# EAGLE design StellaBlue_v04 (EAGLE 9.1.0)
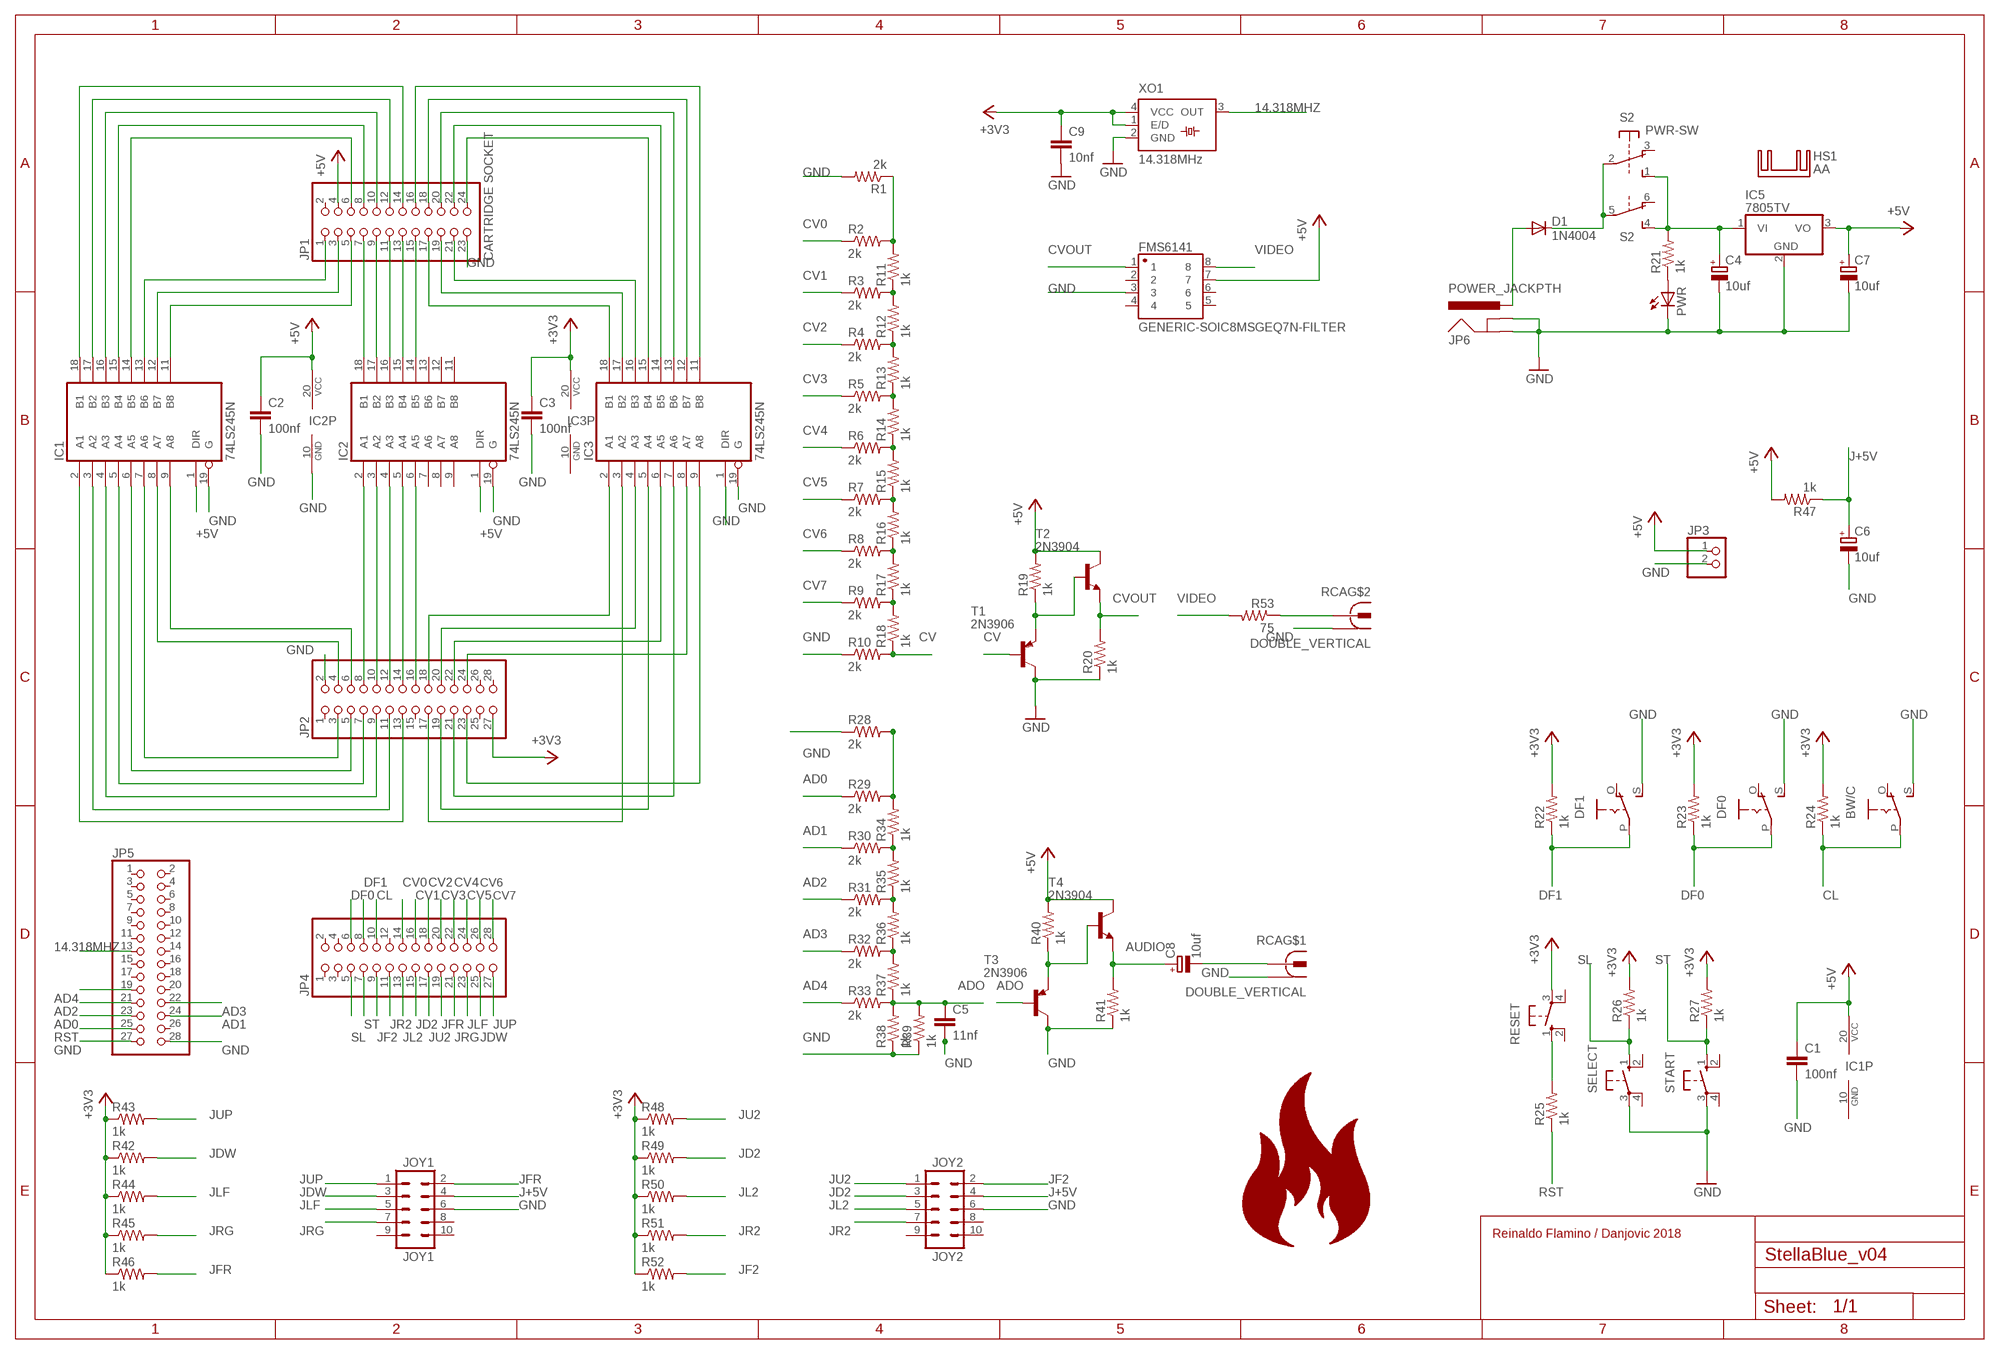
[diagram p0: schematic, sheet 1]

## Parts
BW/C  EG1218S  [EG1218]
C1  100nf  C5/2.5  [C5B2.5]
C2  100nf  C5/2.5  [C5B2.5]
C3  100nf  C5/2.5  [C5B2.5]
C4  10uf  CPOL-EUE2.5-6  [E2,5-6]
C5  11nf  C5/2.5  [C5B2.5]
C6  10uf  CPOL-EUTT2D6  [TT2D6]
C7  10uf  CPOL-EUE2.5-6  [E2,5-6]
C8  10uf  CPOL-EUE2.5-6  [E2,5-6]
C9  10nf  C5/2.5  [C5B2.5]
D1  1N4004  [DO41-10]
DF0  EG1218S  [EG1218]
DF1  EG1218S  [EG1218]
FMS6141  GENERIC-SOIC8MSGEQ7N-FILTER  [SO08]
HS1  AA  [AA]
IC1  74LS245N  [DIL20]
IC2  74LS245N  [DIL20]
IC3  74LS245N  [DIL20]
IC5  7805TV  [TO220V]
JOY1  JOY1  M05X2SHD_LOCK  [2X5-SHROUDED_LOCK]
JOY2  JOY2  M05X2SHD_LOCK  [2X5-SHROUDED_LOCK]
JP1  CARTRIDGE SOCKET  ATARI2600_SLOT  [ATARI2600_SLOT]
JP2  PINHD-2X14  [2X14]
JP3  PINHD-1X2/90  [1X02/90]
JP4  PINHD-2X14  [2X14]
JP5  PINHD-2X14  [2X14]
JP6  POWER_JACKPTH  [POWER_JACK_PTH]
PWR  LED3MM  [LED3MM]
R1  2k  R-US_0207/7  [0207/7]
R2  2k  R-US_0207/7  [0207/7]
R3  2k  R-US_0207/7  [0207/7]
R4  2k  R-US_0207/7  [0207/7]
R5  2k  R-US_0207/7  [0207/7]
R6  2k  R-US_0207/7  [0207/7]
R7  2k  R-US_0207/7  [0207/7]
R8  2k  R-US_0207/7  [0207/7]
R9  2k  R-US_0207/7  [0207/7]
R10  2k  R-US_0207/7  [0207/7]
R11  1k  R-US_0207/7  [0207/7]
R12  1k  R-US_0207/7  [0207/7]
R13  1k  R-US_0207/7  [0207/7]
R14  1k  R-US_0207/7  [0207/7]
R15  1k  R-US_0207/7  [0207/7]
R16  1k  R-US_0207/7  [0207/7]
R17  1k  R-US_0207/7  [0207/7]
R18  1k  R-US_0207/7  [0207/7]
R19  1k  R-US_0207/7  [0207/7]
R20  1k  R-US_0207/7  [0207/7]
R21  1k  R-US_0207/7  [0207/7]
R22  1k  R-US_0207/7  [0207/7]
R23  1k  R-US_0207/7  [0207/7]
R24  1k  R-US_0207/7  [0207/7]
R25  1k  R-US_0207/7  [0207/7]
R26  1k  R-US_0207/7  [0207/7]
R27  1k  R-US_0207/7  [0207/7]
R28  2k  R-US_0207/7  [0207/7]
R29  2k  R-US_0207/7  [0207/7]
R30  2k  R-US_0207/7  [0207/7]
R31  2k  R-US_0207/7  [0207/7]
R32  2k  R-US_0207/7  [0207/7]
R33  2k  R-US_0207/7  [0207/7]
R34  1k  R-US_0207/7  [0207/7]
R35  1k  R-US_0207/7  [0207/7]
R36  1k  R-US_0207/7  [0207/7]
R37  1k  R-US_0207/7  [0207/7]
R38  1k  R-US_0207/7  [0207/7]
R39  1k  R-US_0207/7  [0207/7]
R40  1k  R-US_0207/7  [0207/7]
R41  1k  R-US_0207/7  [0207/7]
R42  1k  R-US_0207/7  [0207/7]
R43  1k  R-US_0207/7  [0207/7]
R44  1k  R-US_0207/7  [0207/7]
R45  1k  R-US_0207/7  [0207/7]
R46  1k  R-US_0207/7  [0207/7]
R47  1k  R-US_0207/7  [0207/7]
R48  1k  R-US_0207/7  [0207/7]
R49  1k  R-US_0207/7  [0207/7]
R50  1k  R-US_0207/7  [0207/7]
R51  1k  R-US_0207/7  [0207/7]
R52  1k  R-US_0207/7  [0207/7]
R53  75  R-US_0207/7  [0207/7]
RCA  DOUBLE_VERTICAL  [DOUBLE-VERTICAL]
RESET  10-XX  [B3F-10XX]
S2  PWR-SW  9077-2  [9077-2]
SELECT  10-XX  [B3F-10XX]
START  10-XX  [B3F-10XX]
T1  2N3906  2N3906-PNP-TO92-EBC  [TO92-EBC]
T2  2N3904  2N3904-NPN-TO92-EBC  [TO92-EBC]
T3  2N3906  2N3906-PNP-TO92-EBC  [TO92-EBC]
T4  2N3904  2N3904-NPN-TO92-EBC  [TO92-EBC]
XO1  14.318MHz  SM77H  [SM77H]

## Nets
14.318MHZ: JP5.13 XO1.3(OUT)
+3V3: C3.1 C9.1 IC3.20(VCC) JP2.27 R22.2 R23.2 R24.2 R26.2 R27.2 R42.1 R43.1 R44.1 R45.1 R46.1 R48.1 R49.1 R50.1 R51.1 R52.1 RESET.3(P) XO1.1(E/D) XO1.4(VCC)
+5V: C1.1 C2.1 C7.+ FMS6141.7 IC1.1(DIR) IC1.20(VCC) IC2.1(DIR) IC2.20(VCC) IC5.3(VO) JP1.4 JP3.1 R19.2 R40.2 R47.2 T2.C T4.C
AD0: JP5.23 R29.1
AD1: JP5.24 R30.1
AD2: JP5.21 R31.1
AD3: JP5.22 R32.1
AD4: JP5.19 R33.1
ADO: C5.1 R33.2 R37.1 R38.2 R39.2 T3.B
AUDIO: C8.+ R41.2 T4.E
CL: BW/C.P JP4.10 R24.1
CV: R10.2 R18.1 T1.B
CV0: JP4.14 R2.1
CV1: JP4.16 R3.1
CV2: JP4.18 R4.1
CV3: JP4.20 R5.1
CV4: JP4.22 R6.1
CV5: JP4.24 R7.1
CV6: JP4.26 R8.1
CV7: JP4.28 R9.1
CVOUT: FMS6141.1 R20.2 T2.E
DF0: DF0.P JP4.6 R23.1
DF1: DF1.P JP4.8 R22.1
GND: BW/C.S C1.2 C2.2 C3.2 C4.- C5.2 C6.- C7.- C9.2 DF0.S DF1.S FMS6141.3 IC1.19(G) IC2.10(GND) IC2.19(G) IC3.1(DIR) IC3.19(G) IC5.2(GND) JOY1.6 JOY2.6 JP1.23 JP2.2 JP3.2 JP5.27 JP5.28 JP6.GND JP6.GNDBREAK PWR.K(C) R1.2 R10.1 R20.1 R28.1 R38.1 R39.1 R41.1 RCA.HG RCA.LG SELECT.3(P) START.3(P) T1.C T3.C XO1.2(GND)
J+5V: C6.+ JOY1.4 JOY2.4 R47.1
JD2: JOY2.3 JP4.15 R49.2
JDW: JOY1.3 JP4.25 R42.2
JF2: JOY2.2 JP4.9 R52.2
JFR: JOY1.2 JP4.19 R46.2
JL2: JOY2.5 JP4.13 R50.2
JLF: JOY1.5 JP4.23 R44.2
JR2: JOY2.7 JP4.11 R51.2
JRG: JOY1.7 JP4.21 R45.2
JU2: JOY2.1 JP4.17 R48.2
JUP: JOY1.1 JP4.27 R43.2
N$1: IC1.18(B1) JP1.14
N$2: IC1.17(B2) JP1.12
N$3: IC1.16(B3) JP1.10
N$4: IC1.15(B4) JP1.8
N$5: IC1.14(B5) JP1.6
N$6: IC1.13(B6) JP1.1
N$7: IC1.12(B7) JP1.3
N$8: IC1.11(B8) JP1.5
N$9: IC2.18(B1) JP1.7
N$10: IC2.17(B2) JP1.9
N$11: IC2.16(B3) JP1.11
N$12: IC2.15(B4) JP1.13
N$13: IC2.14(B5) JP1.15
N$14: IC3.18(B1) JP1.17
N$15: IC3.17(B2) JP1.19
N$16: IC3.16(B3) JP1.21
N$17: IC3.15(B4) JP1.24
N$18: IC3.14(B5) JP1.22
N$19: IC3.13(B6) JP1.20
N$20: IC3.12(B7) JP1.18
N$21: IC3.11(B8) JP1.16
N$22: IC1.2(A1) JP2.13
N$23: IC1.3(A2) JP2.11
N$24: IC1.4(A3) JP2.9
N$25: IC1.5(A4) JP2.7
N$26: IC1.6(A5) JP2.5
N$27: IC1.7(A6) JP2.3
N$28: IC1.8(A7) JP2.4
N$29: IC1.9(A8) JP2.6
N$30: IC2.2(A1) JP2.8
N$31: IC2.3(A2) JP2.10
N$32: IC2.4(A3) JP2.12
N$33: IC2.5(A4) JP2.14
N$34: IC2.6(A5) JP2.16
N$35: IC3.2(A1) JP2.18
N$36: IC3.3(A2) JP2.17
N$37: IC3.4(A3) JP2.20
N$38: IC3.5(A4) JP2.19
N$39: IC3.6(A5) JP2.22
N$40: IC3.7(A6) JP2.21
N$41: IC3.8(A7) JP2.24
N$42: IC3.9(A8) JP2.23
N$43: D1.A JP6.PWR
N$44: D1.C S2.2(1:P) S2.5(2:P)
N$45: R1.1 R2.2 R11.2
N$46: R3.2 R11.1 R12.2
N$47: R53.1 RCA.LS
N$49: C4.+ IC5.1(VI) R21.2 S2.1(1:S) S2.4(2:S)
N$50: R4.2 R12.1 R13.2
N$51: R5.2 R13.1 R14.2
N$52: R6.2 R14.1 R15.2
N$53: R7.2 R15.1 R16.2
N$54: R8.2 R16.1 R17.2
N$55: R9.2 R17.1 R18.2
N$57: R19.1 T1.E T2.B
N$58: PWR.A R21.1
N$59: R25.2 RESET.1(S)
N$62: R28.2 R29.2 R34.2
N$63: R30.2 R34.1 R35.2
N$64: R31.2 R35.1 R36.2
N$65: R32.2 R36.1 R37.2
N$67: R40.1 T3.E T4.B
N$68: C8.- RCA.HS
RST: JP5.25 R25.1
SL: JP4.5 R26.1 SELECT.1(S)
ST: JP4.7 R27.1 START.1(S)
VIDEO: FMS6141.8 R53.2
Unconnected: BW/C.O DF0.O DF1.O FMS6141.2 FMS6141.4 FMS6141.5 FMS6141.6 IC2.7(A6) IC2.8(A7) IC2.9(A8) IC2.11(B8) IC2.12(B7) IC2.13(B6) JOY1.8 JOY1.9 JOY1.10 JOY2.8 JOY2.9 JOY2.10 JP1.2 JP2.1 JP2.15 JP2.25 JP2.26 JP2.28 JP4.1 JP4.2 JP4.3 JP4.4 JP4.12 JP5.1 JP5.2 JP5.3 JP5.4 JP5.5 JP5.6 JP5.7 JP5.8 JP5.9 JP5.10 JP5.11 JP5.12 JP5.14 JP5.15 JP5.16 JP5.17 JP5.18 JP5.20 JP5.26 RESET.2(S1) RESET.4(P1) S2.3(1:O) S2.6(2:O) SELECT.2(S1) SELECT.4(P1) START.2(S1) START.4(P1)

## Notes on the sheet
- Reinaldo Flamino / Danjovic 2018

## Power pins joined to a net without a drawn wire
GND: IC1.10(GND) IC3.10(GND)

## Library data of the parts
BW/C DF0 DF1 = adafruit:EG1218: SLIDING SWITCH 0.1" spacing through hole, vertical SPDT slide switch http://www.ladyada.net/library/pcb/eaglelibrary.html
C1-C3 C5 C9 = capacitor-wima:C: CAPACITOR naming: grid - package width
C4 C6-C8 = resistor:CPOL-EU: POLARIZED CAPACITOR, European symbol
D1 = adafruit:1N4004: DIODE General purpose 1N400x type rectifier (With bigger pads) http://www.ladyada.net/library/pcb/eaglelibrary.html
FMS6141 = SparkFun-AnalogIC:GENERIC-SOIC8: A placeholder for generic narrow & wide SOIC8 foorptints - used on the DIP adapter board.; PROD_ID: IC-10141
HS1 = heatsink:AA
IC1-IC3 = 74xx-us:74*245: Octal BUS TRANSCEIVER, 3-state
IC5 = linear:78*: Positive VOLTAGE REGULATOR Source: http://cache.national.com/ds/LM/LM78L05.pdf http://www.fairchildsemi.com/ds/LM/LM7805.pdf
JOY1 JOY2 = SparkFun-Connectors:M05X2: Header 5x2 Standard 10-pin dual row 0.1" header. Commonly used with AVR-ISP. Use with Spark Fun Electronics SKU: PRT-00778
JP1 = atari2600 card edge:ATARI2600_SLOT: Atari 2600 Slot connector Based on Sullins card edge connector 12/24 pin
JP2 JP4 JP5 = pinhead:PINHD-2X14: PIN HEADER
JP3 = pinhead:PINHD-1X2: PIN HEADER
JP6 = SparkFun-Connectors:POWER_JACK: Power Jack This is the standard 5.5mm barrel jack for power. The PTH is the most common, proven, reliable, footprint. The Slot footprint only works if the mill layer is transmitted to the PCB fab house so be warned. Mating wall wart : TOL-00298 (and others); PROD_ID: CONN-08197
PWR = led:LED: LED OSRAM: - CHIPLED LG R971, LG N971, LY N971, LG Q971, LY Q971, LO R971, LY R971 LH N974, LH R974 LS Q976, LO Q976, LY Q976 LO Q996 - Hyper CHIPLED LW Q18S LB Q993, LB Q99A, LB R99A - SideLED LS A670, LO A670, LY A670, LG A670, LP A670 LB A673, LV A673, LT A673, LW A673 LH A674 LY A675 LS A676, LA A676, LO A676, LY A676, LW A676 LS A679, LY A679, LG A679 - Hyper Micro SIDELED® LS Y876, LA Y876, LO Y876, LY Y876 LT Y87S - SmartLED LW L88C, LW L88S LB L89C, LB L89S, LG L890 LS L89K, LO L89K, LY L89K LS L896, LA L896, LO L896, LY L896 - TOPLED LS T670, LO T670, LY T670, LG T670, LP T670 LSG T670, LSP T670, LSY T670, LOP T670, LYG T670 LG T671, LOG T671, LSG T671 LB T673, LV T673, LT T673, LW T673 LH T674 LS T676, LA T676, LO T676, LY T676, LB T676, LH T676, LSB T676, LW T676 LB T67C, LV T67C, LT T67C, LS T67K, LO T67K, LY T67K, LW E67C LS E67B, LA E67B, LO E67B, LY E67B, LB E67C, LV E67C, LT E67C LW T67C LS T679, LY T679, LG T679 LS T770, LO T770, LY T770, LG T770, LP T770 LB T773, LV T773, LT T773, LW T773 LH T774 LS E675, LA E675, LY E675, LS T675 LS T776, LA T776, LO T776, LY T776, LB T776 LHGB T686 LT T68C, LB T68C - Hyper Mini TOPLED® LB M676 - Mini TOPLED Santana® LG M470 LS M47K, LO M47K, LY M47K Source: http://www.osram.convergy.de LUXEON: - LUMILED® LXK2-PW12-R00, LXK2-PW12-S00, LXK2-PW14-U00, LXK2-PW14-V00 LXK2-PM12-R00, LXK2-PM12-S00, LXK2-PM14-U00 LXK2-PE12-Q00, LXK2-PE12-R00, LXK2-PE12-S00, LXK2-PE14-T00, LXK2-PE14-U00 LXK2-PB12-K00, LXK2-PB12-L00, LXK2-PB12-M00, LXK2-PB14-N00, LXK2-PB14-P00, LXK2-PB14-Q00 LXK2-PR12-L00, LXK2-PR12-M00, LXK2-PR14-Q00, LXK2-PR14-R00 LXK2-PD12-Q00, LXK2-PD12-R00, LXK2-PD12-S00 LXK2-PH12-R00, LXK2-PH12-S00 LXK2-PL12-P00, LXK2-PL12-Q00, LXK2-PL12-R00 Source: www.luxeon.com KINGBRIGHT: KA-3528ASYC Source: www.kingbright.com
R1-R53 = resistor:R-US_: RESISTOR, American symbol
RCA = con-rca-board:DOUBLE_VERTICAL
RESET SELECT START = switch-omron:10-XX: OMRON SWITCH; MPN: B3F-1000; OC_FARNELL: 176432; OC_NEWARK: 36M3542
S2 = switch-misc:9077-2: MARQUARDT SWITCH 9077.0200 Distributor: Buerklin <https://www.buerklin.com/default.asp?event=ShowArtikel%2812G2822%29&l=d&jump=ArtNr_12G2822>
T1 T3 = transistor-neu-to92:*-PNP-: PNP Transistror
T2 T4 = transistor-neu-to92:*-NPN-: NPN Transistror
XO1 = crystal:SM77H: 3.3V CMOS Clock Oscillator Source: www.pletronics.com .. sm77h%203.3v.pdf

## Board
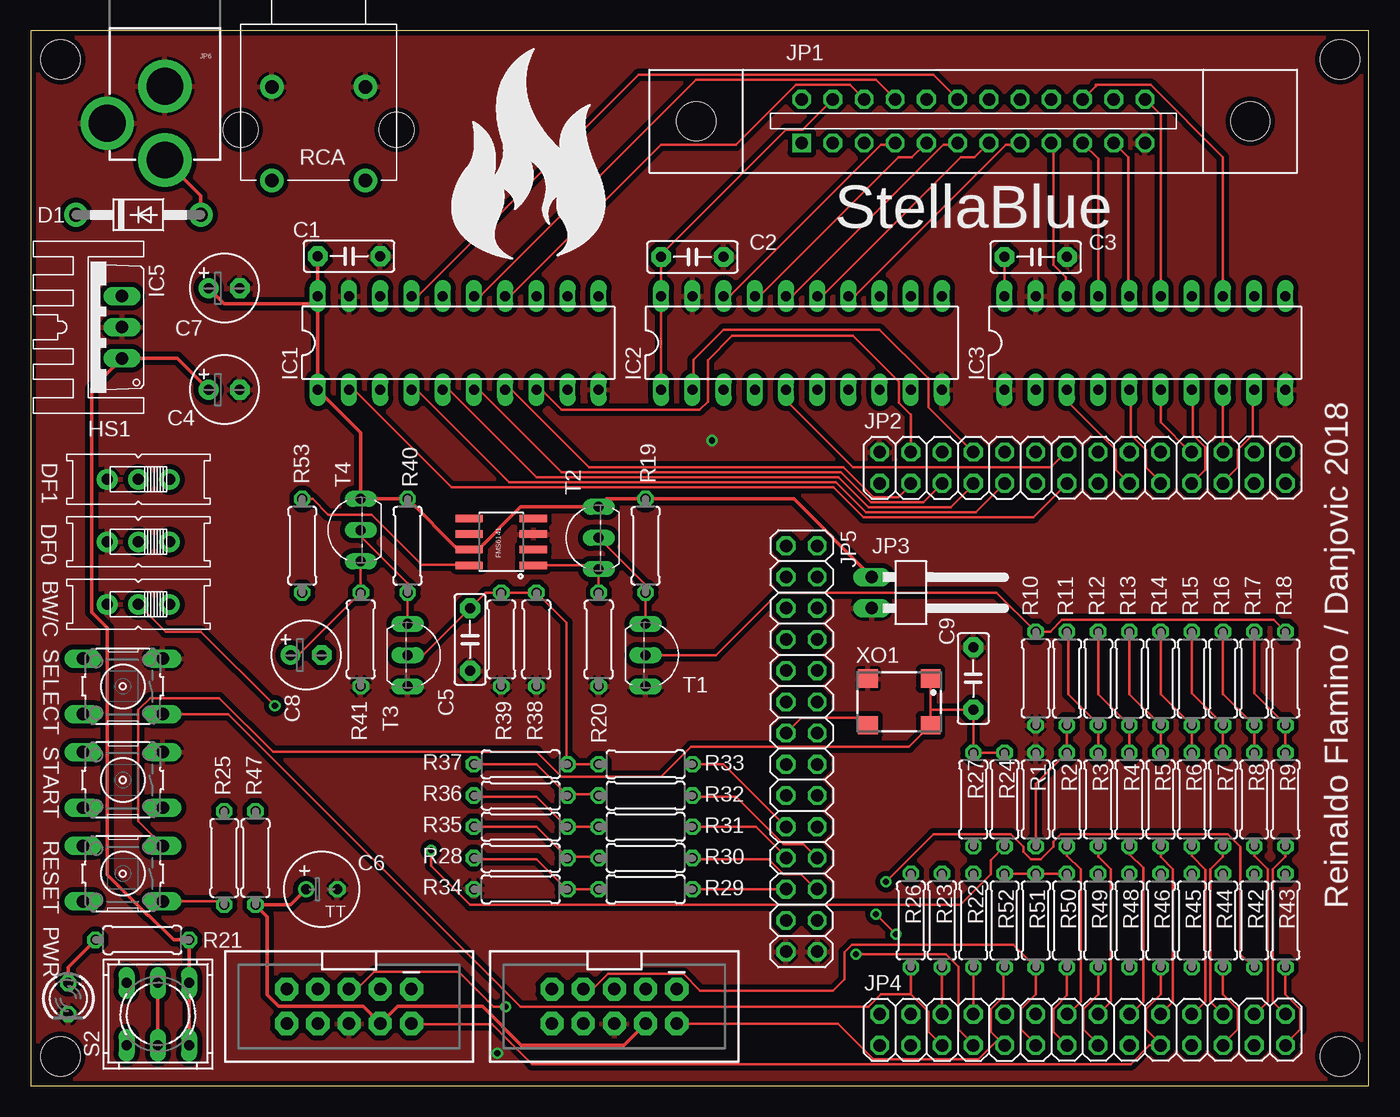
[diagram p1: board, top side]
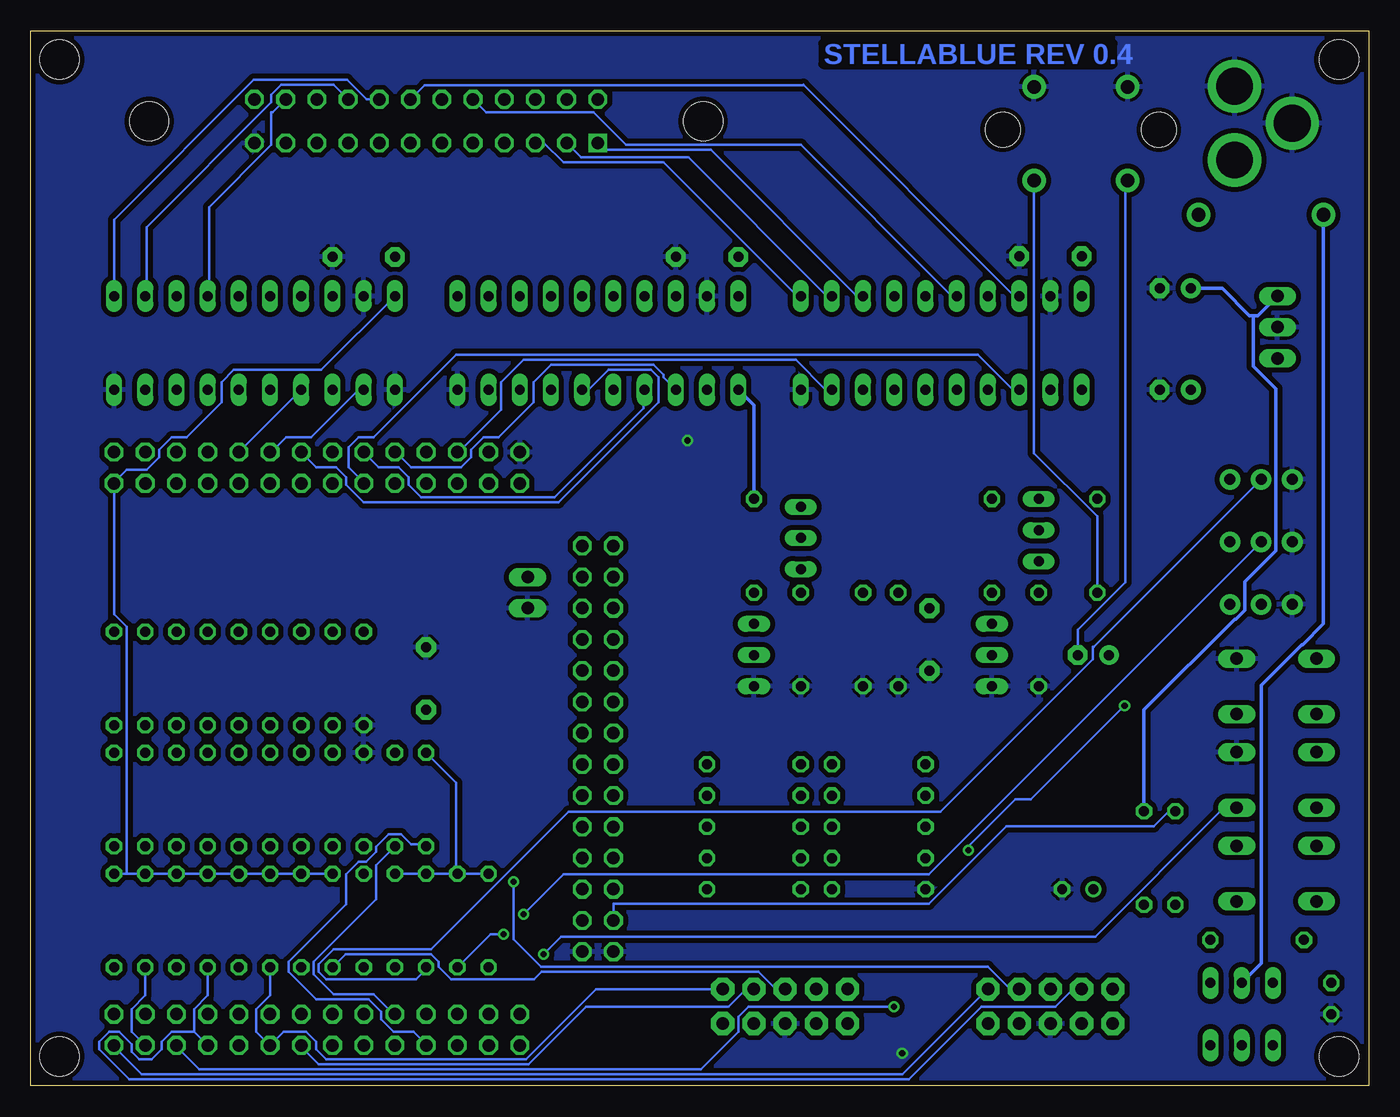
[diagram p2: board, bottom side, seen from below]

Size 108.89 x 85.84 mm. Coordinates in mm from the lower left corner, seen from the top.
Outline: 0,0 108.89,0 108.89,85.84 0,85.84 0,0
Copper layers (1*16): Top 0.035mm / dielectric 1.5mm / Bottom 0.035mm
Design rules "default *": minimum track width 8mil, minimum drill 20mil, track to track 8mil, track to pad 8mil, pad to pad 8mil, via to via 8mil, smd to smd 8mil, copper to edge 8mil, drill to drill 8mil, minimum pad ring 10mil, minimum via ring 8mil, stop-mask expansion 4mil, vias tented up to drill 0mil, thermal gap 10mil
Holes 3.2 mm at 2.41,83.5 2.41,2.41 106.55,2.41 106.55,83.5

### Footprints (pad centres in the part's own frame; a part is rotated, then mirrored left to right if it is on the bottom)
EG1218 = drill 0.9 pad 1.676: O -2.54,0; P 0,0; S 2.54,0
C5B2.5 = drill 0.813 pad 1.6 octagon: 1 -2.54,0; 2 2.54,0
E2,5-6 = drill 0.813 pad 1.6: + -1.27,0 | drill 0.813 pad 1.6 octagon: - 1.27,0
TT2D6 = drill 0.813: + -1.27,0 | drill 0.813 octagon: - 1.27,0
DO41-10 = drill 1.118 pad 1.93: A 5.08,0; C -5.08,0
SO08 = smd 0.61 x 2.21: 1 -1.905,-2.616; 2 -0.635,-2.616; 3 0.635,-2.616; 4 1.905,-2.616; 5 1.905,2.616; 6 0.635,2.616; 7 -0.635,2.616; 8 -1.905,2.616
DIL20 = drill 0.813 long: 1 -11.43,-3.81; 2 -8.89,-3.81; 3 -6.35,-3.81; 4 -3.81,-3.81; 5 -1.27,-3.81; 6 1.27,-3.81; 7 3.81,-3.81; 8 6.35,-3.81; 9 8.89,-3.81; 10 11.43,-3.81; 11 11.43,3.81; 12 8.89,3.81; 13 6.35,3.81; 14 3.81,3.81; 15 1.27,3.81; 16 -1.27,3.81; 17 -3.81,3.81; 18 -6.35,3.81; 19 -8.89,3.81; 20 -11.43,3.81
TO220V = drill 1.016 long: 1 -2.54,-2.54; 2 0,-2.54; 3 2.54,-2.54
2X5-SHROUDED_LOCK = drill 1.016 pad 1.88 octagon: 1 -1.397,5.08; 2 1.397,5.08; 3 -1.397,2.54; 4 1.397,2.54; 5 -1.397,0; 6 1.397,0; 7 -1.397,-2.54; 8 1.397,-2.54; 9 -1.397,-5.08; 10 1.397,-5.08
ATARI2600_SLOT = drill 1.016 square: 1 -13.97,-1.778 | drill 1.016 octagon: 2 -13.97,1.778; 3 -11.43,-1.778; 4 -11.43,1.778; 5 -8.89,-1.778; 6 -8.89,1.778; 7 -6.35,-1.778; 8 -6.35,1.778; 9 -3.81,-1.778; 10 -3.81,1.778; 11 -1.27,-1.778; 12 -1.27,1.778; 13 1.27,-1.778; 14 1.27,1.778; 15 3.81,-1.778; 16 3.81,1.778; 17 6.35,-1.778; 18 6.35,1.778; 19 8.89,-1.778; 20 8.89,1.778; 21 11.43,-1.778; 22 11.43,1.778; 23 13.97,-1.778; 24 13.97,1.778 | hole 3.175: -22.543,0; 22.543,0
2X14 = drill 1.016 octagon: 1 -16.51,-1.27; 2 -16.51,1.27; 3 -13.97,-1.27; 4 -13.97,1.27; 5 -11.43,-1.27; 6 -11.43,1.27; 7 -8.89,-1.27; 8 -8.89,1.27; 9 -6.35,-1.27; 10 -6.35,1.27; 11 -3.81,-1.27; 12 -3.81,1.27; 13 -1.27,-1.27; 14 -1.27,1.27; 15 1.27,-1.27; 16 1.27,1.27; 17 3.81,-1.27; 18 3.81,1.27; 19 6.35,-1.27; 20 6.35,1.27; 21 8.89,-1.27; 22 8.89,1.27; 23 11.43,-1.27; 24 11.43,1.27; 25 13.97,-1.27; 26 13.97,1.27; 27 16.51,-1.27; 28 16.51,1.27
1X02/90 = drill 1.016 long: 1 -1.27,-3.81; 2 1.27,-3.81
POWER_JACK_PTH = drill 2.997 pad 4.318: GND 0,7.7; GNDBREAK 4.7,10.7; PWR 0,13.7
LED3MM = drill 0.813 octagon: A -1.27,0; K 1.27,0
0207/7 = drill 0.813 octagon: 1 -3.81,0; 2 3.81,0
DOUBLE-VERTICAL = drill 1.1 pad 1.93: HG -3.81,3.81; HS -3.81,-3.81; LG 3.81,3.81; LS 3.81,-3.81 | hole 2.8: -6.35,0.318; 6.35,0.318
B3F-10XX = drill 1.016 long: 1 -3.251,2.261; 2 3.251,2.261; 3 -3.251,-2.261; 4 3.251,-2.261
9077-2 = drill 0.813 long: 1 -2.54,2.54; 2 0,2.54; 3 2.54,2.54; 4 -2.54,-2.54; 5 0,-2.54; 6 2.54,-2.54
TO92-EBC = drill 0.813 long: B 0,-1.27; C 2.54,-1.27; E -2.54,-1.27
SM77H = smd 1.6 x 1.5: 1 -2.55,-1.9; 2 2.55,-1.9; 3 2.55,1.9; 4 -2.55,1.9

### Placement (x,y rotation side)
BW/C  8.76,39.18 180 top
C1  25.91,67.5 0 top
C2  53.85,67.44 0 top
C3  81.79,67.44 0 top
C4  15.75,56.64 0 top
C5  35.75,36.32 270 top
C6  23.69,16 0 top
C7  15.75,64.9 0 top
C8  22.42,35.05 0 top
C9  76.71,33.15 90 top
D1  8.76,70.87 0 top
DF0  8.76,44.26 180 top
DF1  8.76,49.34 180 top
FMS6141  38.29,44.26 90 top
HS1  0.19,61.72 270 top
IC1  34.8,60.45 0 top
IC2  62.74,60.45 0 top
IC3  90.68,60.45 0 top
IC5  4.89,61.72 90 top
JOY1  25.91,6.48 270 top
JOY2  47.5,6.48 270 top
JP1  76.71,78.49 0 top
JP2  85.6,50.29 0 top
JP3  72.26,40.13 270 top
JP4  85.6,4.57 0 top
JP5  62.74,27.43 270 top
JP6  10.92,89.03 180 top
PWR  3.05,7.11 270 top
R1  81.79,23.3 90 top
R2  84.33,23.3 90 top
R3  86.87,23.3 90 top
R4  89.41,23.3 90 top
R5  91.95,23.3 90 top
R6  94.49,23.3 90 top
R7  97.03,23.3 90 top
R8  99.57,23.3 90 top
R9  102.11,23.3 90 top
R10  81.79,33.15 90 top
R11  84.33,33.15 270 top
R12  86.87,33.15 270 top
R13  89.41,33.15 270 top
R14  91.95,33.15 270 top
R15  94.49,33.15 270 top
R16  97.03,33.15 270 top
R17  99.57,33.15 270 top
R18  102.11,33.15 270 top
R19  50.04,43.94 90 top
R20  46.23,36.32 90 top
R21  9.08,11.87 0 top
R22  76.71,13.46 90 top
R23  74.17,13.46 90 top
R24  79.25,23.3 90 top
R25  15.75,18.54 270 top
R26  71.63,13.46 90 top
R27  76.71,23.3 90 top
R28  39.88,16 0 top
R29  50.04,16 180 top
R30  50.04,18.54 180 top
R31  50.04,21.08 180 top
R32  50.04,23.62 180 top
R33  50.04,26.16 180 top
R34  39.88,18.54 180 top
R35  39.88,21.08 180 top
R36  39.88,23.62 180 top
R37  39.88,26.16 180 top
R38  41.15,36.32 90 top
R39  38.29,36.32 90 top
R40  30.67,43.94 90 top
R41  26.86,36.32 90 top
R42  99.57,13.46 270 top
R43  102.11,13.46 270 top
R44  97.03,13.46 270 top
R45  94.49,13.46 270 top
R46  91.95,13.46 270 top
R47  18.29,18.54 90 top
R48  89.41,13.46 270 top
R49  86.87,13.46 270 top
R50  84.33,13.46 270 top
R51  81.79,13.46 270 top
R52  79.25,13.46 270 top
R53  22.1,43.94 90 top
RCA  23.43,77.47 0 top
RESET  7.49,17.27 180 top
S2  10.35,5.84 180 top
SELECT  7.49,32.51 180 top
START  7.49,24.89 180 top
T1  51.31,35.05 270 top
T2  44.96,44.58 90 top
T3  31.94,35.05 270 top
T4  25.59,45.21 90 top
XO1  70.68,31.24 180 top

### Tracks (layer width: path | path; a pad name or v marks a point on that pad's centre or on a via)
14.318MHZ
  Top 0.203: XO1.3 67.81,29.34 67.18,29.97 62.74,29.97 JP5.13
+3V3
  Top 0.203: RESET.3 8.76,21.51 8.76,30.61 9.71,31.56 15.33,31.56 19.71,27.18 41.15,27.18 43.18,25.15 51.31,25.15 53.75,27.58 71.47,27.58 XO1.4 73.23,30.61 | 73.23,30.61 XO1.1 | 73.23,30.61 C9.1 R27.2 R24.2 | R52.1 R51.1 R50.1 | C3.1 IC3.20
  Bottom 0.203: R27.2 74.27,24.68 74.27,17.37 R23.2 | R26.2 R23.2 | R23.2 R22.2 R52.1 | R50.1 R49.1 R48.1 R46.1 R45.1 R44.1 R42.1 101.16,17.27 | 101.16,17.27 R43.1 | 101.16,17.27 101.09,17.34 101.09,37.34 102.11,38.35 102.11,48.92 JP2.27 102.11,49.12 101.09,50.14 99.47,50.14 98.45,51.16 98.45,51.77 97.43,52.78 96.21,52.78 93.37,55.63 93.37,57.25 92.35,58.27 85.24,58.27 IC3.20
+5V
  Top 0.203: IC2.1 51.31,64.16 IC2.20 51.31,64.36 51.31,67.41 C2.1 51.31,67.61 61.47,77.78 62.79,77.78 JP1.4
  Top 0.305: C7.+ 15.75,63.63 22.73,63.63 IC1.20 | IC1.20 IC1.1 26.86,53.15 T4.C R40.2 34.8,43.62 FMS6141.7 36.39,43.62 39.88,47.12 T2.C | T2.C 46.86,47.75 | T2.C 46.86,47.75 | 46.86,47.75 R19.2 62.1,47.75 JP3.1 | IC1.20 C1.1
  Bottom 0.305: C7.+ 11.94,64.9 9.71,62.67 9.4,62.67 | 9.4,62.67 9.02,62.67 IC5.3 | 9.4,62.67 9.4,58.55 7.57,56.72 7.57,43.55 10.11,41.01 10.11,38.69 10.81,37.99 10.91,37.99 18.29,30.61 R47.2 | R19.2 50.04,55.37 IC2.1
AD0
  Top 0.203: JP5.23 53.95,16 R29.1
AD1
  Top 0.203: R30.1 53.95,18.44 60.05,18.44 61.27,17.22 62.69,17.22 63.91,16 JP5.24
AD2
  Top 0.203: R31.1 53.95,21.08 59.03,21.08 61.47,18.64 JP5.21
AD3
  Top 0.203: R32.1 53.95,23.52 57.4,23.52 61.27,19.66 62.89,19.66 63.91,18.64 JP5.22
AD4
  Top 0.203: JP5.19 56.39,26.16 53.95,26.16 R33.1
ADO
  Top 0.203: R33.2 43.79,26.16 R37.1 43.59,26.16 43.59,37.69 R38.2 R39.2 37.02,40.13 C5.1 31.94,35.05 T3.B
AUDIO
  Top 0.203: T4.E R41.2 21.78,35.05 C8.+
CL  (via drill 0.51)
  Top 0.203: BW/C.P 10.98,36.96 13.84,36.96 v19.88,30.93 | v32.58,19.18 32.58,17.91 35.75,14.73 75.64,14.73 78.13,17.22 78.13,18.38 R24.1
  Bottom 0.203: JP4.10 79.35,5.84 80.97,7.47 84.23,7.47 85.85,9.09 85.85,10.11 80.77,15.19 80.77,17.97 R24.1 | v19.88,30.93 27.5,23.3 28.77,23.3 32.58,19.5 v32.58,19.18
CV
  Top 0.203: T1.B 55.75,35.05 60.83,40.13 78.59,40.13 81.79,36.93 R10.2 82.96,36.96 83.93,37.92 101.14,37.92 R18.1
CV0
  Top 0.203: JP4.14 84.43,5.84 85.45,6.86 85.45,17.63 84.33,18.75 R2.1
CV1
  Top 0.203: JP4.16 87.88,6.86 87.88,17.63 86.87,18.64 86.87,19.46 R3.1
CV2
  Top 0.203: JP4.18 89.51,5.84 90.53,6.86 90.53,17.74 89.41,18.86 R4.1
CV3
  Top 0.203: JP4.20 92.96,6.86 92.96,17.63 91.95,18.64 91.95,19.46 R5.1
CV4
  Top 0.203: JP4.22 94.59,5.84 95.61,6.86 95.61,17.59 94.49,18.71 R6.1
CV5
  Top 0.203: JP4.24 96.01,6.86 96.01,17.63 97.03,18.64 97.03,19.46 R7.1
CV6
  Top 0.203: JP4.26 99.67,5.84 100.69,6.86 100.69,17.63 99.57,18.75 R8.1
CV7
  Top 0.203: JP4.28 101.09,6.86 101.09,17.63 102.11,18.64 102.11,19.46 R9.1
CVOUT
  Top 0.203: FMS6141.1 45.91,42.36 T2.E R20.2
DF0  (via drill 0.51)
  Top 0.203: v70.41,12.34 v68.78,13.97 | R23.1 JP4.6
  Bottom 0.203: v68.78,13.97 65.53,17.22 35.8,17.22 DF0.P | R23.1 71.48,12.34 v70.41,12.34
DF1
  Top 0.203: JP4.8 76.71,9.5 R22.1
  Bottom 0.203: R22.1 76.71,9.5 77.52,8.69 84.84,8.69 85.45,9.3 85.45,9.91 84.23,11.12 76.3,11.12 65.13,22.3 34.85,22.3 22.45,34.7 22.45,35.71 22.39,35.71 DF1.P
GND  (via drill 0.51)
  other vias: 37.97,2.67 55.44,52.51
  pour Bottom (isolate 0.406): 0,86.17 108.97,86.17 108.97,0 0,0
  pour Top (isolate 0.406): 0.32,85.85 109.28,85.85 108.97,0 0,0
J+5V
  Top 0.305: C6.+ 21.14,14.73 R47.1 19.24,13.78 19.24,7.43 20.19,6.48 27.05,6.48 JOY1.4 29.84,6.48 36.75,6.48 39.9,3.33 48.29,3.33 JOY2.4
JD2
  Top 0.203: R49.2 86.87,9.5 86.87,7.47 85.65,6.25 85.65,4.62 86.87,3.4 JP4.15
  Bottom 0.203: JOY2.3 50.09,7.87 50.7,7.87 52.12,6.45 63.7,6.45 68.38,1.78 85.45,1.78 86.87,3.2 JP4.15
JDW  (via drill 0.51)
  Top 0.203: v69.6,16.61 73.46,20.47 79.76,20.47 80.77,19.46 80.77,19.05 81.38,18.44 82.19,18.44 83.21,19.46 83.21,19.86 83.82,20.47 97.43,20.47 98.45,19.46 98.45,10.72 99.52,9.65 R42.2
  Bottom 0.203: JP4.25 99.67,3.4 100.69,4.42 100.69,6.25 99.57,7.37 R42.2 | v69.6,16.61 69.6,11.94 67.36,9.7 30.99,9.7 29.16,7.87 28.55,7.87 JOY1.3
JF2
  Top 0.203: 78.74,3.81 79.15,3.4 JP4.9 78.74,3.81 | 78.74,3.81 78.13,4.42 78.13,6.25 79.15,7.26 79.15,9.55 R52.2 | 78.74,3.81 77.11,2.18 68.58,2.18 65.68,5.08 JOY2.2
JFR
  Top 0.203: R46.2 91.95,9.5 91.95,7.47 90.73,6.25 90.73,4.62 91.95,3.4 JP4.19 91.03,3.3 89.51,1.78 89.41,1.78 40.8,1.78 37.55,5.03 30.99,5.03 JOY1.2
JL2
  Top 0.203: JP4.13 84.23,3.4 83.21,4.42 83.21,6.25 84.33,7.37 R50.2
  Bottom 0.203: JOY2.5 47.65,7.87 48.26,7.87 49.68,9.3 67.32,9.3 67.93,8.69 74.68,8.69 75.69,9.7 75.69,10.11 76.3,10.72 83.26,10.72 R50.2
JLF  (via drill 0.51)
  Top 0.203: R44.2 97.03,9.5 97.03,7.47 98.25,6.25 98.25,4.62 97.03,3.4 JP4.23 | JOY1.5 26.52,7.87 27.94,9.3 34.84,9.3 37.68,6.45 v38.63,6.45
  Bottom 0.203: v38.63,6.45 50.5,6.45 51.31,5.64 51.31,4.42 54.36,1.37 95.2,1.37 97.03,3.2 JP4.23
JR2
  Top 0.203: JP4.11 81.79,3.4 80.57,4.62 80.57,6.25 81.79,7.47 R51.2 79.96,11.48 66.84,11.48 66.23,10.87 66.23,8.7 | JOY2.7 45.74,7.87 46.98,9.12 53.11,9.12 54.48,7.75 | 54.48,7.75 | 54.48,7.75 65.28,7.75 66.23,8.7 | 66.23,8.7
JRG
  Bottom 0.203: 95.61,4.42 95.61,6.25 94.49,7.37 R45.2 | 95.61,4.42 94.59,3.4 JP4.21 | 95.61,4.42 97.43,4.42 98.25,3.61 98.25,3 99.06,2.18 100.08,2.18 100.69,2.79 100.69,3.4 101.7,4.42 102.51,4.42 103.33,3.61 103.33,3 100.89,0.56 37.41,0.56 31.52,6.45 25.5,6.45 24.08,7.87 23.47,7.87 JOY1.7
JU2
  Bottom 0.203: JOY2.1 52.73,7.87 62.89,7.87 68.58,2.18 84.84,2.18 85.65,3 85.65,3.61 86.46,4.42 88.29,4.42 89.31,3.4 JP4.17 89.51,3.4 90.53,4.42 90.53,6.25 89.41,7.37 R48.2
JUP
  Top 0.203: R43.2 102.11,9.5 102.11,7.47 103.33,6.25 103.33,4.62 102.11,3.4 JP4.27
  Bottom 0.203: JOY1.1 31.03,7.87 37.94,0.97 99.87,0.97 102.11,3.2 JP4.27
N$1
  Bottom 0.203: IC1.18 28.55,64.36 28.96,64.36 46.03,81.43 46.05,81.41 76.83,81.41 JP1.14
N$2
  Top 0.203: IC1.17 30.99,64.36 31.6,64.36 49.48,82.25 73.46,82.25 75.29,80.42 JP1.12
N$3
  Bottom 0.203: IC1.16 33.63,64.36 34.04,64.36 46.23,76.56 60.45,76.56 63.09,79.2 71.83,79.2 72.85,80.21 JP1.10
N$4
  Top 0.203: IC1.15 36.07,64.36 36.68,64.36 54.15,81.84 68.78,81.84 70.21,80.42 JP1.8
N$5
  Top 0.203: IC1.14 38.71,64.36 39.12,64.36 51.31,76.56 57.4,76.56 62.28,81.43 66.65,81.43 JP1.6
N$6
  Bottom 0.203: IC1.13 41.15,64.36 41.76,64.36 53.54,76.15 62.1,76.15 62.18,76.15 JP1.1
N$7
  Bottom 0.203: IC1.12 43.79,64.36 44.2,64.36 55.37,75.54 64.11,75.54 65.13,76.56 JP1.3
N$8
  Bottom 0.203: IC1.11 46.23,64.36 46.63,64.36 57.4,75.13 65.53,75.13 67.1,76.71 JP1.5
N$9
  Top 0.203: IC2.18 56.39,64.36 57,64.36 69.19,76.56 70.21,76.56 JP1.7
N$10
  Top 0.203: IC2.17 59.03,64.36 59.44,64.36 70.61,75.54 71.73,75.54 JP1.9
N$11
  Top 0.203: IC2.16 61.47,64.36 62.08,64.36 74.27,76.56 75.29,76.56 JP1.11
N$12
  Top 0.203: IC2.15 64.11,64.36 64.52,64.36 75.69,75.54 76.81,75.54 JP1.13
N$13
  Top 0.203: IC2.14 66.55,64.36 67.16,64.36 79.35,76.56 80.37,76.56 JP1.15
N$14
  Top 0.203: IC3.18 84.23,64.36 84.23,65.79 83.21,66.8 83.21,76.56 JP1.17
N$15
  Top 0.203: JP1.19 86.87,75.44 IC3.17
N$16
  Top 0.203: IC3.16 89.31,64.36 89.31,75.54 88.29,76.56 JP1.21
N$17
  Top 0.203: IC3.15 91.95,64.36 91.95,78.99 90.73,80.21 JP1.24
N$18
  Bottom 0.203: IC3.14 94.39,64.36 94.39,71.48 89.31,76.56 89.31,79.2 89.2,79.2 JP1.22
N$19
  Top 0.203: IC3.13 97.03,64.36 97.03,75.54 91.13,81.43 86.66,81.43 86.66,81.33 JP1.20
N$20
  Bottom 0.203: IC3.12 99.47,64.36 99.47,69.85 89.31,80.01 89.31,80.62 88.49,81.43 84.23,81.43 83.21,80.42 JP1.18
N$21
  Bottom 0.203: IC3.11 102.11,64.36 102.11,70.46 90.73,81.84 83.12,81.84 81.55,80.26 JP1.16
N$22
  Top 0.203: IC1.2 26.31,56.64 34.24,48.72 65.33,48.72 67.77,46.28 81.58,46.28 84.23,48.92 JP2.13
N$23
  Bottom 0.203: IC1.3 28.55,56.64 28.96,56.64 31.8,59.49 74.27,59.49 80.97,52.78 82.19,52.78 83.01,51.97 83.01,50.34 81.79,49.12 JP2.11
N$24
  Top 0.203: IC1.4 31.39,56.64 38.91,49.12 65.53,49.12 67.97,46.69 76.91,46.69 79.15,48.92 JP2.9
N$25
  Top 0.203: IC1.5 33.63,56.64 34.04,56.64 41.15,49.53 65.73,49.53 68.17,47.09 74.88,47.09 76.71,48.92 JP2.7
N$26
  Top 0.203: IC1.6 36.47,56.64 43.18,49.94 65.94,49.94 68.38,47.5 72.64,47.5 74.07,48.92 JP2.5
N$27
  Top 0.203: IC1.7 38.71,56.64 39.12,56.64 45.41,50.34 66.14,50.34 68.58,47.9 70.61,47.9 71.63,48.92 JP2.3
N$28
  Top 0.203: IC1.8 41.55,56.64 43.18,55.02 54.45,55.02 55.11,55.68 55.11,59.04 57.09,61.02 66.93,61.02 70.66,57.29 70.66,55.58 71.63,54.62 JP2.4
N$29
  Bottom 0.203: IC1.9 43.79,56.64 44.2,56.64 46.63,59.08 68.78,59.08 70.61,57.25 70.61,55.02 74.07,51.56 JP2.6
N$30
  Top 0.203: JP2.8 73.05,55.22 73.05,57.57 69.09,61.53 56.39,61.53 53.95,59.09 53.95,56.64 IC2.2
N$31
  Bottom 0.203: IC2.3 57.4,57.66 57.4,57.86 58.22,58.67 66.55,58.67 67.97,57.25 67.97,55.63 70.81,52.78 72.03,52.78 73.05,51.77 73.05,51.16 73.86,50.34 77.93,50.34 79.15,51.56 JP2.10
N$32
  Bottom 0.203: JP2.12 80.57,50.34 78.94,50.34 78.13,49.53 78.13,48.92 77.11,47.9 66.27,47.9 59.03,55.14 59.03,56.64 IC2.4
N$33
  Top 0.203: JP2.14 84.23,51.56 83.01,50.34 66.9,50.34 61.47,55.78 IC2.5
N$34
  Bottom 0.203: JP2.16 85.65,50.34 84.02,50.34 83.21,49.53 83.21,48.92 81.79,47.5 65.94,47.5 57.81,55.63 57.81,57.66 58.42,58.27 61.87,58.27 63.5,56.64 63.91,56.64 IC2.6
N$35
  Bottom 0.203: IC3.2 82.19,56.64 86.05,52.78 88.09,52.78 89.31,51.56 JP2.18
N$36
  Top 0.203: IC3.3 84.43,56.64 84.43,55.63 88.29,51.77 88.29,50.14 89.31,49.12 JP2.17
N$37
  Bottom 0.203: JP2.20 IC3.4
N$38
  Top 0.203: IC3.5 89.51,56.64 89.51,52.98 90.73,51.77 90.73,50.34 91.95,49.12 JP2.19
N$39
  Top 0.203: IC3.6 91.95,54 94.39,51.56 JP2.22
N$40
  Top 0.203: IC3.7 94.59,56.64 94.59,52.98 95.61,51.97 95.61,50.14 94.59,49.12 JP2.21
N$41
  Top 0.203: JP2.24 IC3.8
N$42
  Top 0.203: IC3.9 99.47,56.64 99.47,52.98 98.25,51.77 98.25,50.34 97.03,49.12 JP2.23
N$43
  Top 0.305: JP6.PWR 13.84,72.41 D1.A
N$44
  Top 0.305: S2.5 S2.2
  Bottom 0.305: D1.C 3.68,37.59 5.38,35.89 5.47,35.89 8.76,32.59 8.76,9.97 S2.5
N$45
  Top 0.203: R11.2 R2.2 81.79,24.57 R1.1
N$46
  Top 0.203: R3.2 86.87,27.18 86.87,29.21 R12.2 86.87,29.41 84.43,31.85 84.43,36.86 R11.1
N$47
  Bottom 0.203: R53.1 22.1,46.33 27.24,51.47 RCA.LS
N$49
  Top 0.305: S2.1 S2.4 R21.2 11.62,11.88 9.6,13.89 9.52,13.89 6.22,17.19 6.22,37.27 4.95,38.54 4.95,56.71 IC5.1 11.94,59.18 C4.+
N$50
  Top 0.203: R12.1 86.87,36.93 86.87,31.85 86.89,31.85 R13.2 R4.2
N$51
  Top 0.203: R13.1 89.41,31.88 R14.2 R5.2
N$52
  Top 0.203: R14.1 91.95,36.93 91.95,31.85 91.97,31.85 R15.2 R6.2
N$53
  Top 0.203: R7.2 97.03,27.18 97.03,29.21 R16.2 97.03,29.41 94.49,31.95 R15.1
N$54
  Top 0.203: R16.1 97.03,36.93 97.03,31.85 97.05,31.85 R17.2 R8.2
N$55
  Top 0.203: R9.2 102.11,27.18 102.11,29.21 R18.2 102.11,29.41 99.57,31.95 R17.1
N$57
  Top 0.203: T2.B 50.04,40.77 R19.1 T1.E
N$58
  Top 0.305: R21.1 3.05,9.65 PWR.A
N$59
  Top 0.203: RESET.1 15.47,15.01 R25.2
N$62
  Top 0.203: R29.2 43.79,16 R28.2 43.59,16 41.15,18.44 36.07,18.44 R34.2
N$63
  Top 0.203: R30.2 46.23,18.64 43.79,18.64 R34.1 43.59,18.64 41.15,21.08 R35.2
N$64
  Top 0.203: R31.2 43.79,21.08 R35.1 43.59,21.08 41.15,23.52 36.07,23.52 R36.2
N$65
  Top 0.203: R32.2 46.23,23.72 43.79,23.72 R36.1 43.59,23.72 41.15,26.16 R37.2
N$67
  Top 0.203: T3.E R40.1 30.67,40.91 26.86,44.72 T4.B
N$68
  Bottom 0.203: C8.- 23.68,37.12 19.81,41 19.81,73.47 RCA.HS
RST
  Bottom 0.203: R25.1 15.75,22.3 16.33,22.3 17.49,21.15 29.5,21.15 35.81,14.83 61.47,14.83 JP5.25
SL
  Top 0.203: 71.63,7.47 71.63,9.5 R26.1 | 71.63,7.47 73.05,6.04 73.05,4.42 74.07,3.4 JP4.5 | 71.63,7.47 69.19,7.47 68.17,6.45 39.85,6.45 16.05,30.25 SELECT.1
ST  (via drill 0.51)
  Top 0.203: v67.16,10.72 74.47,10.72 75.49,9.7 75.49,4.62 76.71,3.4 JP4.7
  Bottom 0.203: R27.1 76.71,19.66 77.93,19.66 78.74,20.47 79.76,20.47 80.77,19.46 80.77,19.05 81.58,18.24 82.19,18.24 83.21,17.22 83.21,14.78 87.88,10.11 87.88,9.3 85.65,7.06 81.38,7.06 80.37,6.04 80.37,5.44 79.35,4.42 77.72,4.42 76.71,3.4 JP4.7 | v67.16,10.72 65.73,12.14 22.26,12.14 11.9,22.5 10.87,22.5 START.1
VIDEO
  Top 0.203: FMS6141.8 35.61,42.42 31.8,42.42 27.75,46.47 24.21,46.47 22.93,47.75 R53.2

### Text on the board
Bottom: STELLABLUE REV 0.4
tPlace: StellaBlue | Reinaldo Flamino / Danjovic 2018
tDocu: GND